# Altium schematic sheet [08] - MCU.SchDoc
size A3; SheetNumber: 9; SheetTotal: 10
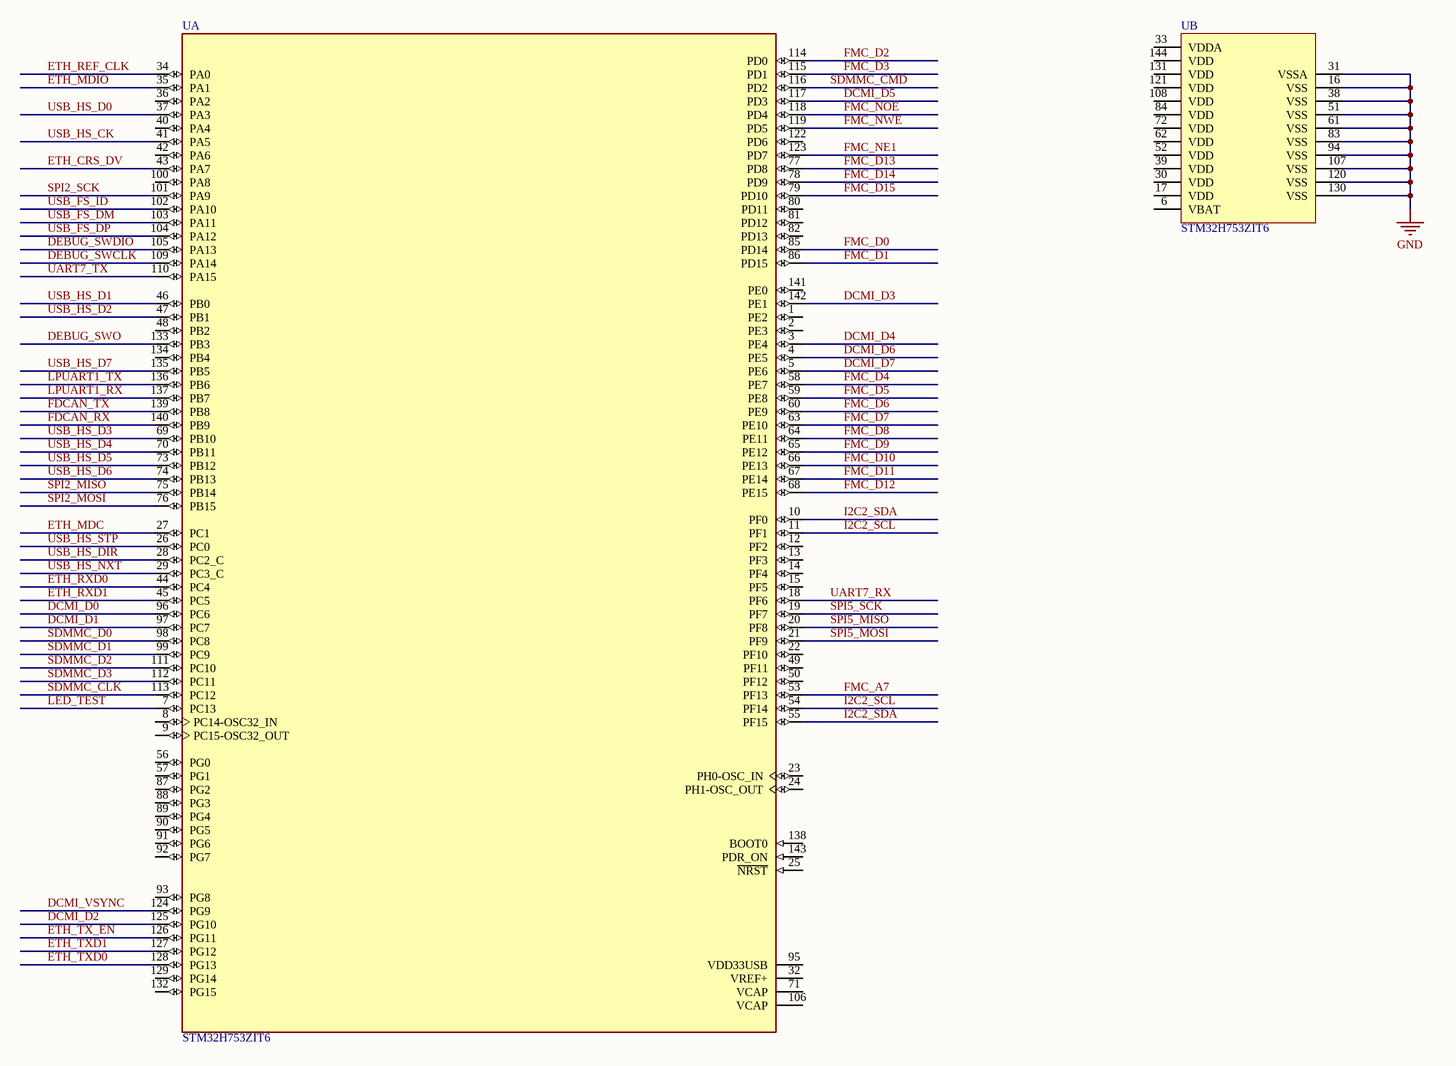
[diagram p0: [08] - MCU.SchDoc]

## Parts
U  STM32H753ZIT6  [ST_MCU_STM32H753ZIT6_LQFP144]  (parts A,B of 2)

## Nets
GND: U.16(VSS) U.31(VSSA) U.38(VSS) U.51(VSS) U.61(VSS) U.83(VSS) U.94(VSS) U.107(VSS) U.120(VSS) U.130(VSS)
DCMI_D0: U.96(PC6)
DCMI_D1: U.97(PC7)
DCMI_D2: U.125(PG10)
DCMI_D3: U.142(PE1)
DCMI_D4: U.3(PE4)
DCMI_D5: U.117(PD3)
DCMI_D6: U.4(PE5)
DCMI_D7: U.5(PE6)
DCMI_VSYNC: U.124(PG9)
DEBUG_SWCLK: U.109(PA14)
DEBUG_SWDIO: U.105(PA13)
DEBUG_SWO: U.133(PB3)
ETH_CRS_DV: U.43(PA7)
ETH_MDC: U.27(PC1)
ETH_MDIO: U.35(PA1)
ETH_REF_CLK: U.34(PA0)
ETH_RXD0: U.44(PC4)
ETH_RXD1: U.45(PC5)
ETH_TX_EN: U.126(PG11)
ETH_TXD0: U.128(PG13)
ETH_TXD1: U.127(PG12)
FDCAN_RX: U.140(PB9)
FDCAN_TX: U.139(PB8)
FMC_A7: U.53(PF13)
FMC_D0: U.85(PD14)
FMC_D1: U.86(PD15)
FMC_D2: U.114(PD0)
FMC_D3: U.115(PD1)
FMC_D4: U.58(PE7)
FMC_D5: U.59(PE8)
FMC_D6: U.60(PE9)
FMC_D7: U.63(PE10)
FMC_D8: U.64(PE11)
FMC_D9: U.65(PE12)
FMC_D10: U.66(PE13)
FMC_D11: U.67(PE14)
FMC_D12: U.68(PE15)
FMC_D13: U.77(PD8)
FMC_D14: U.78(PD9)
FMC_D15: U.79(PD10)
FMC_NE1: U.123(PD7)
FMC_NOE: U.118(PD4)
FMC_NWE: U.119(PD5)
I2C2_SCL: U.11(PF1) U.54(PF14)
I2C2_SDA: U.10(PF0) U.55(PF15)
LED_TEST: U.7(PC13)
LPUART1_RX: U.137(PB7)
LPUART1_TX: U.136(PB6)
SDMMC_CLK: U.113(PC12)
SDMMC_CMD: U.116(PD2)
SDMMC_D0: U.98(PC8)
SDMMC_D1: U.99(PC9)
SDMMC_D2: U.111(PC10)
SDMMC_D3: U.112(PC11)
SPI2_MISO: U.75(PB14)
SPI2_MOSI: U.76(PB15)
SPI2_SCK: U.101(PA9)
SPI5_MISO: U.20(PF8)
SPI5_MOSI: U.21(PF9)
SPI5_SCK: U.19(PF7)
UART7_RX: U.18(PF6)
UART7_TX: U.110(PA15)
USB_FS_DM: U.103(PA11)
USB_FS_DP: U.104(PA12)
USB_FS_ID: U.102(PA10)
USB_HS_CK: U.41(PA5)
USB_HS_D0: U.37(PA3)
USB_HS_D1: U.46(PB0)
USB_HS_D2: U.47(PB1)
USB_HS_D3: U.69(PB10)
USB_HS_D4: U.70(PB11)
USB_HS_D5: U.73(PB12)
USB_HS_D6: U.74(PB13)
USB_HS_D7: U.135(PB5)
USB_HS_DIR: U.28(PC2_C)
USB_HS_NXT: U.29(PC3_C)
USB_HS_STP: U.26(PC0)

Not connected (* = marked no-connect by the designer): U 1(PE2) 2(PE3) 6(VBAT) 8(PC14-OSC32_IN) 9(PC15-OSC32_OUT) 12(PF2) 13(PF3) 14(PF4) 15(PF5) 17(VDD) 22(PF10) 23(PH0-OSC_IN) 24(PH1-OSC_OUT) 25(~{NRST}) 30(VDD) 32(VREF+) 33(VDDA) 36(PA2) 39(VDD) 40(PA4) 42(PA6) 48(PB2) 49(PF11) 50(PF12) 52(VDD) 56(PG0) 57(PG1) 62(VDD) 71(VCAP) 72(VDD) 80(PD11) 81(PD12) 82(PD13) 84(VDD) 87(PG2) 88(PG3) 89(PG4) 90(PG5) 91(PG6) 92(PG7) 93(PG8) 95(VDD33USB) 100(PA8) 106(VCAP) 108(VDD) 121(VDD) 122(PD6) 129(PG14) 131(VDD) 132(PG15) 134(PB4) 138(BOOT0) 141(PE0) 143(PDR_ON) 144(VDD)

## Library data of the parts
U = STM32H753ZIT6: ARMÂ® CortexÂ®-M7 STM32H7 Microcontroller IC 32-Bit 480MHz 2MB _2M x 8_ FLASH 144-LQFP _20x20_; MF: STMicroelectronics; Package: LQFP-144 STMicroelectronics; Value: *; SnapEDA_Link: https://www.snapeda.com/parts/STM32H753ZIT6/STMicroelectronics/view-part/2461811/?ref=snap; MP: STM32H753ZIT6; Supplier: Mouser; Supplier URL: https://www.mouser.vn/ProductDetail/STMicroelectronics/STM32H753ZIT6?qs=u4fy%2FsgLU9PzR9vtNNw%2FMw%3D%3D; ComponentLink1Description: Datasheet; ComponentLink1URL: https://www.st.com/resource/en/datasheet/stm32h753vi.pdf